# EAGLE design MazeBot Main Board (EAGLE 9.2.2)
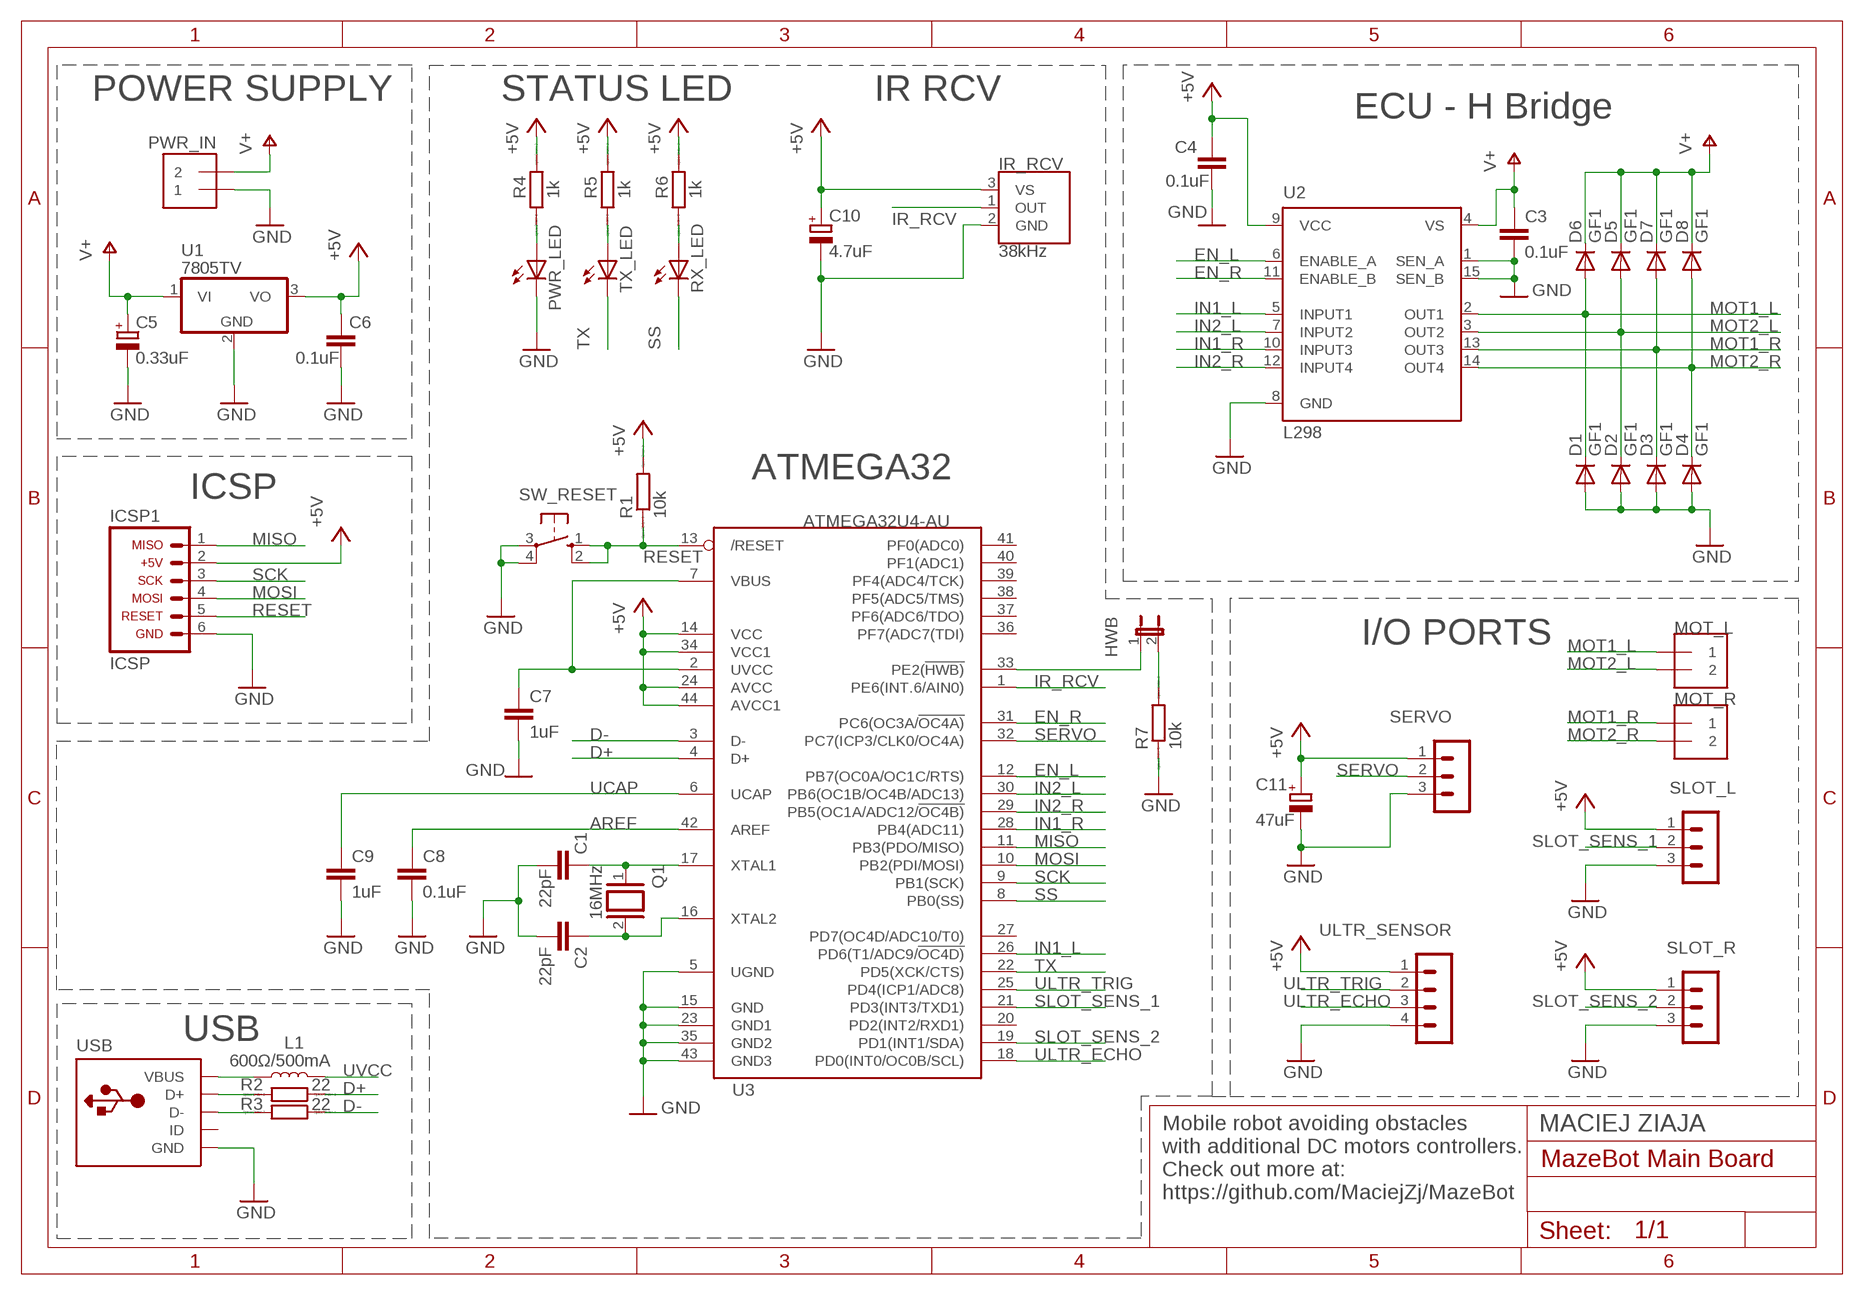
[diagram p0: schematic, sheet 1]
FRAME1 (A4L-LOC): AUTHOR: MACIEJ ZIAJA

## Parts
C1  22pF  C-EU025-024X044  [C025-024X044]
C2  22pF  C-EU025-024X044  [C025-024X044]
C3  0.1uF  C-EU025-024X044  [C025-024X044]
C4  0.1uF  C-EU025-024X044  [C025-024X044]
C5  0.33uF  CPOL-EUUD-4X5,8  [UD-4X5,8_NICHICON]
C6  0.1uF  C-EU025-024X044  [C025-024X044]
C7  1uF  C-EU025-024X044  [C025-024X044]
C8  0.1uF  C-EU025-024X044  [C025-024X044]
C9  1uF  C-EU025-024X044  [C025-024X044]
C10  4.7uF  CPOL-EUUD-6,3X8,8  [UD-6,3X5,8_NICHICON]
C11  47uF  CPOL-EUUD-6,3X8,8  [UD-6,3X5,8_NICHICON]
D1  GF1  [SMA-DO214AC]
D2  GF1  [SMA-DO214AC]
D3  GF1  [SMA-DO214AC]
D4  GF1  [SMA-DO214AC]
D5  GF1  [SMA-DO214AC]
D6  GF1  [SMA-DO214AC]
D7  GF1  [SMA-DO214AC]
D8  GF1  [SMA-DO214AC]
HWB  JP1E  [JP1]
ICSP1  ARDUINO_CONN-ICSP  [CONN-2X03]
IR_RCV  38kHz  TSOP38238  [TSOP382]
L1  600Ω/500mA  INDUCTOR-0805-3.3UH  [0805]
MOT_L  1X2-3.5MM  [1X2-3.5MM]
MOT_R  1X2-3.5MM  [1X2-3.5MM]
PWR_IN  1X2-3.5MM  [1X2-3.5MM]
PWR_LED  LEDCHIP-LED0805  [CHIP-LED0805]
Q1  16MHz  XTAL/S  [QS]
R1  10k  RR1206  [R1206]
R2  22  RR1206  [R1206]
R3  22  RR1206  [R1206]
R4  1k  RR1206  [R1206]
R5  1k  RR1206  [R1206]
R6  1k  RR1206  [R1206]
R7  10k  RR1206  [R1206]
RX_LED  LEDCHIP-LED0805  [CHIP-LED0805]
SERVO  MA03-1  [MA03-1]
SLOT_L  MA03-1  [MA03-1]
SLOT_R  MA03-1  [MA03-1]
SW_RESET  10-XX  [B3F-10XX]
TX_LED  LEDCHIP-LED0805  [CHIP-LED0805]
U1  7805TV  [TO220V]
U2  L298  [MULTIWATT-15]
U3  ATMEGA32U4-AU  [TQFP44]
ULTR_SENSOR  MA04-1  [MA04-1]
USB  USBMINIB  [USB-MINIB]

## Nets
+5V: C4.1 C6.1 C10.+ C11.+ ICSP1.2 IR_RCV.3(VS) R1.2 R4.2 R5.2 R6.2 SERVO.1 SLOT_L.1 SLOT_R.1 U1.3(VO) U2.9(VCC) U3.14(VCC) U3.24(AVCC) U3.34(VCC1) U3.44(AVCC1) ULTR_SENSOR.1
AREF: C8.1 U3.42(AREF)
D+: R2.1 U3.4(D+)
D-: R3.1 U3.3(D-)
EN_L: U2.6(ENABLE_A) U3.12(PB7(OC0A/OC1C/RTS))
EN_R: U2.11(ENABLE_B) U3.31(PC6(OC3A/!OC4A))
GND: C1.1 C2.2 C3.2 C4.2 C5.- C6.2 C7.2 C8.2 C9.2 C10.- C11.- D1.A D2.A D3.A D4.A ICSP1.6 IR_RCV.2(GND) PWR_IN.1 PWR_LED.C R7.1 SERVO.3 SLOT_L.3 SLOT_R.3 SW_RESET.3(P) SW_RESET.4(P1) U1.2(GND) U2.1(SEN_A) U2.8(GND) U2.15(SEN_B) U3.5(UGND) U3.15(GND) U3.23(GND1) U3.35(GND2) U3.43(GND3) ULTR_SENSOR.4 USB.GND
IN1_L: U2.5(INPUT1) U3.26(PD6(T1/ADC9/!OC4D))
IN1_R: U2.10(INPUT3) U3.28(PB4(ADC11))
IN2_L: U2.7(INPUT2) U3.30(PB6(OC1B/OC4B/ADC13))
IN2_R: U2.12(INPUT4) U3.29(PB5(OC1A/ADC12/!OC4B))
IR_RCV: IR_RCV.1(OUT) U3.1(PE6(INT.6/AIN0))
MISO: ICSP1.1 U3.11(PB3(PDO/MISO))
MOSI: ICSP1.4 U3.10(PB2(PDI/MOSI))
MOT1_L: D1.K(C) D6.A MOT_L.1 U2.2(OUT1)
MOT1_R: D3.K(C) D7.A MOT_R.1 U2.13(OUT3)
MOT2_L: D2.K(C) D5.A MOT_L.2 U2.3(OUT2)
MOT2_R: D4.K(C) D8.A MOT_R.2 U2.14(OUT4)
N$1: C1.2 Q1.1 U3.17(XTAL1)
N$2: C2.1 Q1.2 U3.16(XTAL2)
N$3: PWR_LED.A R4.1
N$4: R2.2 USB.D+
N$5: R3.2 USB.D-
N$6: R5.1 TX_LED.A
N$7: R6.1 RX_LED.A
N$8: HWB.1 U3.33(PE2(!HWB))
N$9: HWB.2 R7.2
N$10: L1.1 USB.VBUS
RESET: ICSP1.5 R1.1 SW_RESET.1(S) SW_RESET.2(S1) U3.13(/RESET)
SCK: ICSP1.3 U3.9(PB1(SCK))
SERVO: SERVO.2 U3.32(PC7(ICP3/CLK0/OC4A))
SLOT_SENS_1: SLOT_L.2 U3.21(PD3(INT3/TXD1))
SLOT_SENS_2: SLOT_R.2 U3.19(PD1(INT1/SDA))
SS: RX_LED.C U3.8(PB0(SS))
TX: TX_LED.C U3.22(PD5(XCK/CTS))
UCAP: C9.1 U3.6(UCAP)
ULTR_ECHO: U3.18(PD0(INT0/OC0B/SCL)) ULTR_SENSOR.3
ULTR_TRIG: U3.25(PD4(ICP1/ADC8)) ULTR_SENSOR.2
UVCC: C7.1 L1.2 U3.2(UVCC) U3.7(VBUS)
V+: C3.1 C5.+ D5.K(C) D6.K(C) D7.K(C) D8.K(C) PWR_IN.2 U1.1(VI) U2.4(VS)
Unconnected: U3.20(PD2(INT2/RXD1)) U3.27(PD7(OC4D/ADC10/T0)) U3.36(PF7(ADC7(TDI)) U3.37(PF6(ADC6/TDO)) U3.38(PF5(ADC5/TMS)) U3.39(PF4(ADC4/TCK)) U3.40(PF1(ADC1)) U3.41(PF0(ADC0)) USB.ID

## Notes on the sheet
- POWER SUPPLY | STATUS LED | IR RCV
- ECU - H Bridge
- ATMEGA32
- ICSP
- I/O PORTS
- USB
- Mobile robot avoiding obstacles
  with additional DC motors controllers.
  Check out more at:
  https://github.com/MaciejZj/MazeBot

## Library data of the parts
C1-C4 C6-C9 = rcl:C-EU: CAPACITOR, European symbol; SPICEPREFIX: C
C5 C10 C11 = rcl:CPOL-EU: POLARIZED CAPACITOR, European symbol; SPICEPREFIX: C
D1-D8 = diode:GF1: DIODE
HWB = jumper:JP1E: JUMPER
ICSP1 = arduino_jw:ARDUINO_CONN-ICSP: Arduino ICSP I/O Header This is the ICSP I/O header on the Arduino Uno R3. This connector is labeled with the following pin assignments: MISO +5V SCK MOSI RESET GND NOTE: Be sure you install this connector with the correct orientation on your PCB layout. Pin 1 has a square pad to assist with orientation.
IR_RCV = SparkFun-Sensors:TSOP382: Vishay Semiconductor TSOP32838 - 38kHz IR Receiver These products are miniaturized IR receiver modules for infrared remote control systems. A PIN diode and a preamplifier are assembled on a leadframe, the epoxy package contains an IR filter. The demodulated output signal can be directly connected to a microprocessor for decoding.; PROD_ID: SEN-10266
L1 = SparkFun-Coils:INDUCTOR: Inductors Resist changes in electrical current. Basically a coil of wire. SparkFun Products: SparkFun Load Cell Amplifier - HX711 <https://www.sparkfun.com/products/13879> IOIO-OTG - V2.2 <https://www.sparkfun.com/products/13613>; PROD_ID: NDUC-13076; VALUE: 3.3µH/±20%/450mA
MOT_L MOT_R PWR_IN = adafruit:1X2: 3.5mm Terminal block http://www.ladyada.net/library/pcb/eaglelibrary.html
PWR_LED RX_LED TX_LED = led:LED: LED OSRAM: - CHIPLED LG R971, LG N971, LY N971, LG Q971, LY Q971, LO R971, LY R971 LH N974, LH R974 LS Q976, LO Q976, LY Q976 LO Q996 - Hyper CHIPLED LW Q18S LB Q993, LB Q99A, LB R99A - SideLED LS A670, LO A670, LY A670, LG A670, LP A670 LB A673, LV A673, LT A673, LW A673 LH A674 LY A675 LS A676, LA A676, LO A676, LY A676, LW A676 LS A679, LY A679, LG A679 - Hyper Micro SIDELED® LS Y876, LA Y876, LO Y876, LY Y876 LT Y87S - SmartLED LW L88C, LW L88S LB L89C, LB L89S, LG L890 LS L89K, LO L89K, LY L89K LS L896, LA L896, LO L896, LY L896 - TOPLED LS T670, LO T670, LY T670, LG T670, LP T670 LSG T670, LSP T670, LSY T670, LOP T670, LYG T670 LG T671, LOG T671, LSG T671 LB T673, LV T673, LT T673, LW T673 LH T674 LS T676, LA T676, LO T676, LY T676, LB T676, LH T676, LSB T676, LW T676 LB T67C, LV T67C, LT T67C, LS T67K, LO T67K, LY T67K, LW E67C LS E67B, LA E67B, LO E67B, LY E67B, LB E67C, LV E67C, LT E67C LW T67C LS T679, LY T679, LG T679 LS T770, LO T770, LY T770, LG T770, LP T770 LB T773, LV T773, LT T773, LW T773 LH T774 LS E675, LA E675, LY E675, LS T675 LS T776, LA T776, LO T776, LY T776, LB T776 LHGB T686 LT T68C, LB T68C - Hyper Mini TOPLED® LB M676 - Mini TOPLED Santana® LG M470 LS M47K, LO M47K, LY M47K Source: http://www.osram.convergy.de LUXEON: - LUMILED® LXK2-PW12-R00, LXK2-PW12-S00, LXK2-PW14-U00, LXK2-PW14-V00 LXK2-PM12-R00, LXK2-PM12-S00, LXK2-PM14-U00 LXK2-PE12-Q00, LXK2-PE12-R00, LXK2-PE12-S00, LXK2-PE14-T00, LXK2-PE14-U00 LXK2-PB12-K00, LXK2-PB12-L00, LXK2-PB12-M00, LXK2-PB14-N00, LXK2-PB14-P00, LXK2-PB14-Q00 LXK2-PR12-L00, LXK2-PR12-M00, LXK2-PR14-Q00, LXK2-PR14-R00 LXK2-PD12-Q00, LXK2-PD12-R00, LXK2-PD12-S00 LXK2-PH12-R00, LXK2-PH12-S00 LXK2-PL12-P00, LXK2-PL12-Q00, LXK2-PL12-R00 Source: www.luxeon.com KINGBRIGHT: KA-3528ASYC Source: www.kingbright.com
Q1 = special:XTAL/S: CRYSTAL
R1-R7 = eagle-ltspice:R: RESISTOR, European symbol; SPICEMODEL: NONE; SPICEPREFIX: R
SERVO SLOT_L SLOT_R = EAGLE_std_edits_MZ:MA03-1: PIN HEADER; OC_FARNELL: unknown; OC_NEWARK: unknown
SW_RESET = switch-omron:10-XX: OMRON SWITCH; MPN: B3F-1000; OC_FARNELL: 176432; OC_NEWARK: 36M3542
U1 = linear:78*: Positive VOLTAGE REGULATOR Source: http://cache.national.com/ds/LM/LM78L05.pdf http://www.fairchildsemi.com/ds/LM/LM7805.pdf
U2 = EAGLE_std_edits_MZ:L298: DUAL FULL-BRIDGE DRIVER; MPN: L298N; OC_FARNELL: 1589425; OC_NEWARK: 32M1527
U3 = adafruit:ATMEGA32U4: http://www.ladyada.net/library/eagle
ULTR_SENSOR = EAGLE_std_edits_MZ:MA04-1: PIN HEADER; OC_FARNELL: unknown; OC_NEWARK: unknown
USB = adafruit:USB: USB Connectors USBMINIB - Surface Mount Female Mini-B USB Connector 4UConnector: 06564 By microbuilder.eu Thru-hole RA Female Mini-B USB Connector 4UConnector: 18732 By ladyada.net

## Board
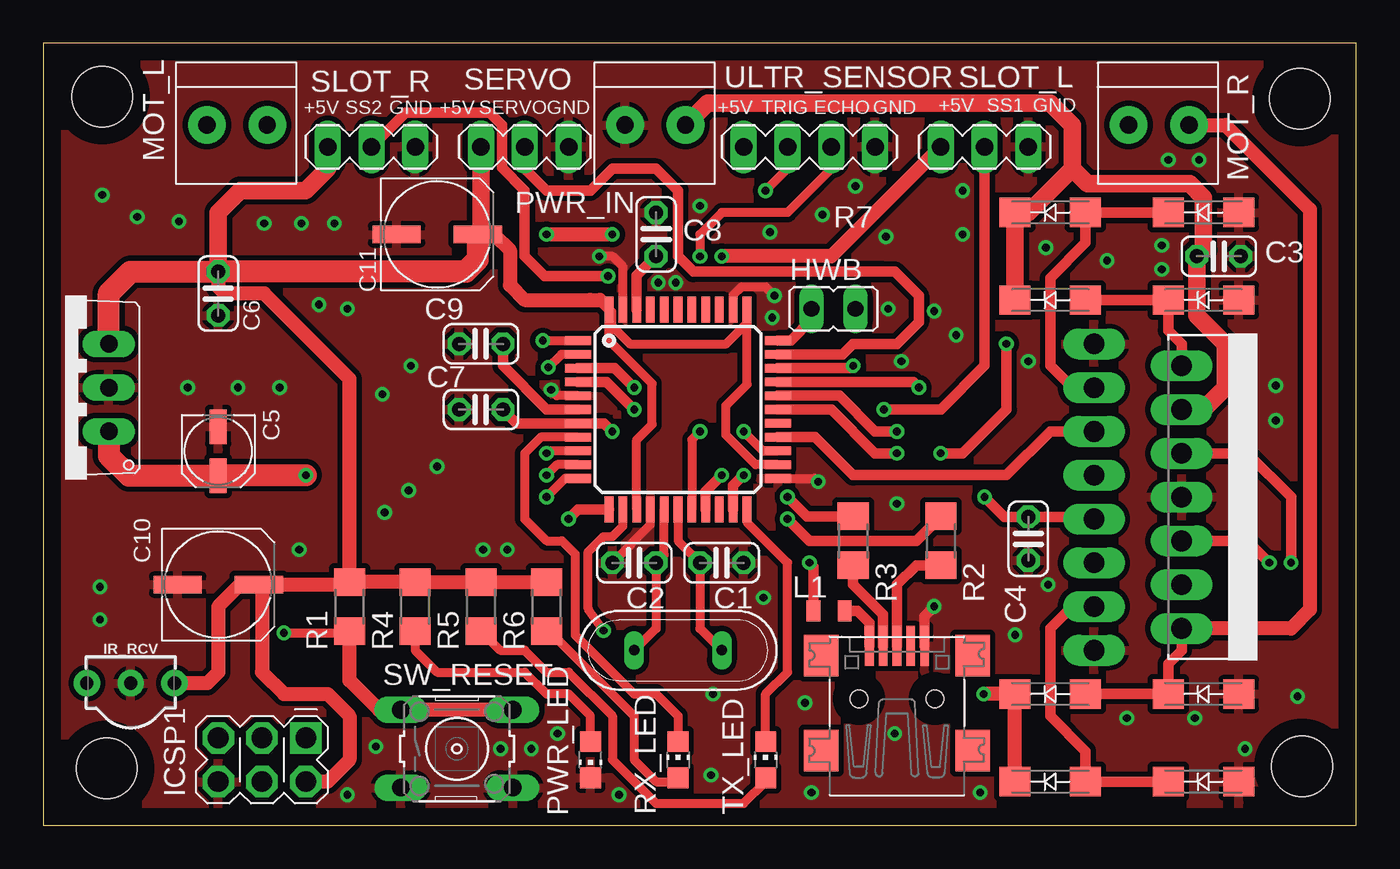
[diagram p1: board, top side]
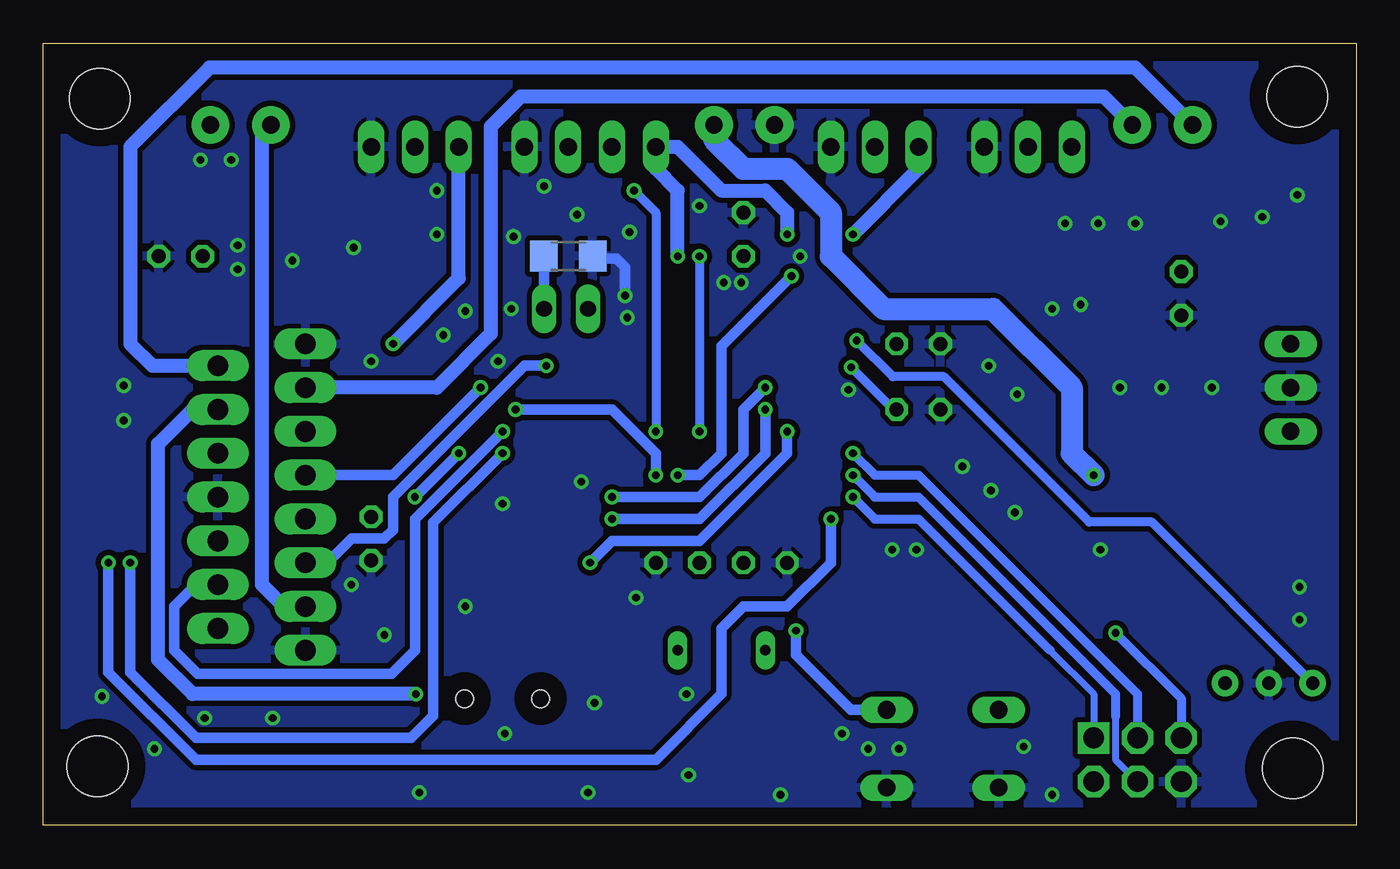
[diagram p2: board, bottom side, seen from below]

Size 76.18 x 45.39 mm. Coordinates in mm from the lower left corner, seen from the top.
Outline: 0,0 76.18,0 76.18,45.39 0,45.39 0,0
Copper layers (1*16): Top 0.035mm / dielectric 1.5mm / Bottom 0.035mm
Design rules "default": minimum track width 6mil, minimum drill 0.35mm, track to track 6mil, track to pad 6mil, pad to pad 6mil, via to via 6mil, smd to smd 6mil, copper to edge 40mil, drill to drill 6mil, minimum pad ring 10mil, minimum via ring 8mil, stop-mask expansion 4mil, vias tented up to drill 0mil, thermal gap 10mil
Holes 3.5 mm at 3.68,3.3 3.43,42.29 73.03,3.43 72.9,42.16

### Footprints (pad centres in the part's own frame; a part is rotated, then mirrored left to right if it is on the bottom)
C025-024X044 = drill 0.813 octagon: 1 -1.27,0; 2 1.27,0
UD-4X5,8_NICHICON = smd 2 x 1: + 1.425,0; - -1.425,0
UD-6,3X5,8_NICHICON = smd 2.8 x 1: + 2.35,0; - -2.35,0
SMA-DO214AC = smd 1.8 x 1.7: A -2.05,0; K 2.05,0
JP1 = drill 0.914 long: 1 0,-1.27; 2 0,1.27
CONN-2X03 = drill 1.2 pad 1.829 square: 1 0,0 | drill 1.2 pad 1.829 octagon: 2 2.54,0; 3 0,-2.54; 4 2.54,-2.54; 5 0,-5.08; 6 2.54,-5.08
TSOP382 = drill 0.762 pad 1.524: 1 -2.54,0; 2 0,0; 3 2.54,0
0805 = smd 0.8 x 1.2: 1 -0.9,0; 2 0.9,0
1X2-3.5MM = drill 1 pad 2.184: 1 1.8,0; 2 -1.7,0
CHIP-LED0805 = smd 1.2 x 1.2: A 0,-1.05; C 0,1.05
QS = drill 0.61 long: 1 -2.54,0; 2 2.54,0
R1206 = smd 1.6 x 1.803: 1 -1.422,0; 2 1.422,0
MA03-1 = drill 1.016 long: 1 -2.54,0; 2 0,0; 3 2.54,0
B3F-10XX = drill 1.016 long: 1 -3.251,2.261; 2 3.251,2.261; 3 -3.251,-2.261; 4 3.251,-2.261
TO220V = drill 1.016 long: 1 -2.54,-2.54; 2 0,-2.54; 3 2.54,-2.54
MULTIWATT-15 = drill 1.2 long: 1 -8.89,-7.62; 2 -7.62,-2.54; 3 -6.35,-7.62; 4 -5.08,-2.54; 5 -3.81,-7.62; 6 -2.54,-2.54; 7 -1.27,-7.62; 8 0,-2.54; 9 1.27,-7.62; 10 2.54,-2.54; 11 3.81,-7.62; 12 5.08,-2.54; 13 6.35,-7.62; 14 7.62,-2.54; 15 8.89,-7.62
TQFP44 = smd 1.5 x 0.5: 1 -5.8,4; 2 -5.8,3.2; 3 -5.8,2.4; 4 -5.8,1.6; 5 -5.8,0.8; 6 -5.8,0; 7 -5.8,-0.8; 8 -5.8,-1.6; 9 -5.8,-2.4; 10 -5.8,-3.2; 11 -5.8,-4; 23 5.8,-4; 24 5.8,-3.2; 25 5.8,-2.4; 26 5.8,-1.6; 27 5.8,-0.8; 28 5.8,0; 29 5.8,0.8; 30 5.8,1.6; 31 5.8,2.4; 32 5.8,3.2; 33 5.8,4 | smd 0.5 x 1.5: 12 -4,-5.8; 13 -3.2,-5.8; 14 -2.4,-5.8; 15 -1.6,-5.8; 16 -0.8,-5.8; 17 0,-5.8; 18 0.8,-5.8; 19 1.6,-5.8; 20 2.4,-5.8; 21 3.2,-5.8; 22 4,-5.8; 34 4,5.8; 35 3.2,5.8; 36 2.4,5.8; 37 1.6,5.8; 38 0.8,5.8; 39 0,5.8; 40 -0.8,5.8; 41 -1.6,5.8; 42 -2.4,5.8; 43 -3.2,5.8; 44 -4,5.8
MA04-1 = drill 1.016 long: 1 -3.81,0; 2 -1.27,0; 3 1.27,0; 4 3.81,0
USB-MINIB = smd 0.5 x 2.308: D+ 0,4.064; D- -0.8,4.064; GND 1.6,4.064; ID 0.8,4.064; VBUS -1.6,4.064 | smd 2 x 2.4: GND1 -4.4,-2; GND2 -4.4,3.5; GND3 4.4,3.5; GND4 4.4,-2 | hole 1: -2.2,1; 2.2,1

### Placement (x,y rotation side)
C1  39.37,15.24 180 top
C2  34.29,15.24 180 top
C3  68.2,33.02 0 top
C4  57.15,16.64 270 top
C5  10.16,21.72 270 top
C6  10.16,30.86 270 top
C7  25.4,24.13 180 top
C8  35.56,34.29 90 top
C9  25.4,27.94 180 top
C10  10.16,13.97 0 top
C11  22.86,34.29 0 top
D1  67.31,30.48 180 top
D2  67.31,35.56 180 top
D3  67.31,2.54 180 top
D4  67.31,7.62 180 top
D5  58.42,35.56 180 top
D6  58.42,30.48 180 top
D7  58.42,2.54 180 top
D8  58.42,7.62 180 top
HWB  45.85,29.97 270 top
ICSP1  15.24,5.08 270 top
IR_RCV  5.08,8.26 0 top
L1  45.59,12.45 180 top
MOT_L  11.3,40.64 180 top
MOT_R  64.77,40.64 180 top
PWR_IN  35.56,40.64 180 top
PWR_LED  31.75,3.81 180 top
Q1  36.83,10.16 180 top
R1  17.78,12.7 90 top
R2  52.07,16.51 270 top
R3  46.99,16.51 270 top
R4  21.59,12.7 90 top
R5  25.4,12.7 90 top
R6  29.21,12.7 90 top
R7  45.72,33.02 180 bottom
RX_LED  36.83,3.81 0 top
SERVO  27.94,39.37 0 top
SLOT_L  54.61,39.37 0 top
SLOT_R  19.05,39.37 0 top
SW_RESET  24,4.45 0 top
TX_LED  41.91,3.81 0 top
U1  1.27,25.4 90 top
U2  68.58,19.05 270 top
U3  36.83,24.13 0 top
ULTR_SENSOR  44.45,39.37 0 top
USB  49.53,6.35 0 top

### Tracks (layer width: path | path; a pad name or v marks a point on that pad's centre or on a via)
+5V  (via drill 0.45)
  Top 0.508: U3.14 34.43,22.36 35.33,23.26 35.33,25.64 32.83,28.14 U3.44 32.97,29.79 32.97,29.01 34.05,27.94 39.62,27.94 40.83,29.16 U3.34 40.83,25.59 39.6,24.36 39.6,22.66 41.33,20.93 U3.24
  Top 0.61: v52.07,21.59 53.34,21.59 55.88,24.13 v55.88,27.94 | v54.61,19.05 55.75,17.91 C4.1 60.83,17.91 U2.9 | 32.28,30.48 U3.44
  Top 0.813: 25.4,34.48 C11.+ 26.16,34.29 27.08,33.38 27.08,31.34 27.94,30.48 31.75,30.48 32.28,30.48 | R1.2 R4.2 R5.2 R6.2 | C10.+ 17.63,13.97 R1.2 | C10.+ 12.7,13.78 12.7,8.89 13.97,7.62 16.51,7.62 17.78,6.35 17.78,3.81 16.51,2.54 ICSP1.2 | C10.+ 11.43,13.97 10.16,12.7 10.16,8.89 9.53,8.26 IR_RCV.3 | SLOT_L.1 45.72,33.02 v39.37,33.02 | v33.02,34.29 v29.21,34.29 | C6.1 10.16,31.24 10.54,30.86 12.83,30.86 17.78,25.91 R1.2
  Top 1.016: 25.4,34.48 SERVO.1 | SLOT_R.1 16.51,38.1 15.24,36.83 11.43,36.83 10.16,35.56 C6.1
  Top 1.27: C11.+ 25.21,32.83 24.51,32.13 C6.1 5.08,32.13 3.81,30.86 U1.3
  Bottom 0.61: v54.61,19.05 v52.07,21.59
  Bottom 0.813: v55.88,27.94 52.07,31.75 SLOT_L.1 | v39.37,33.02 39.37,36.83 40.64,38.1 ULTR_SENSOR.1 39.37,39.37 36.83,36.83 34.29,36.83 33.02,35.56 v33.02,34.29 | v29.21,34.29 25.4,38.1 SERVO.1
AREF
  Top 0.61: C8.1 34.43,31.89 U3.42
D+  (via drill 0.45)
  Top 0.61: R2.1 50.65,16.51 44.45,16.51 v43.18,17.78 | U3.4 32.69,25.73 v34.29,24.13
  Bottom 0.61: v43.18,17.78 38.1,17.78 34.29,21.59 v34.29,24.13
D-  (via drill 0.45)
  Top 0.61: R3.1 44.3,17.93 v43.18,19.05 | U3.3 33.16,26.53 v34.29,25.4
  Bottom 0.61: v43.18,19.05 38.1,19.05 35.56,21.59 35.56,24.13 v34.29,25.4
EN_L  (via drill 0.45)
  Top 0.61: U2.6 69.85,21.59 72.39,19.05 v72.39,15.24 | v30.48,17.78 31.03,18.33 U3.12
  Bottom 0.61: v72.39,15.24 72.39,8.89 67.31,3.81 | v30.48,17.78 30.48,15.24 33.02,12.7 35.56,12.7 36.83,11.43 36.83,7.62 40.64,3.81 | 67.31,3.81 40.64,3.81 | 67.31,3.81 40.64,3.81
EN_R  (via drill 0.45)
  Top 0.61: v46.99,26.67 46.85,26.53 U3.31
  Bottom 0.61: U2.11 59.69,15.24 58.29,16.64 56.39,16.64 55.88,17.14 55.88,19.05 48.26,26.67 v46.99,26.67
GND  (via drill 0.45)
  Top 0.508: U3.5 29.81,24.93 v29.46,25.27 | U3.43 33.63,32.41 33.02,33.02 v32.26,33.02 | v42.42,30.73 41.91,31.24 40.51,31.24 40.03,30.76 U3.35 | C2.2 35.23,17.45 U3.15 | U3.23 44.77,20.13 v44.96,19.94
  Top 0.61: USB.GND 51.13,12.14 v51.69,12.7
  Bottom 0.61: v42.42,30.73 42.42,32.38 42.93,32.89 44.17,32.89 R7.1
  other vias: 49.53,18.67 62.87,6.22 66.8,6.22 69.72,4.45 72.77,7.49 58.29,13.97 56.39,11.05 38.1,35.94 35.69,31.5 36.7,31.5 48.9,34.16 49.78,26.92 42.16,34.42 45.21,35.43 47.12,37.08 3.3,13.84 3.3,11.94 19.81,18.16 22.86,20.83 19.68,25.02 21.34,26.67 12.83,34.92 14.99,34.92 16.89,34.92 17.65,29.97 16,30.23 21.21,19.43 3.43,36.58 5.46,35.31 7.87,35.05 19.3,4.57 17.65,1.78 28.32,4.45 26.54,4.45 29.84,5.33 33.4,1.78 41.78,13.21 38.86,7.62 38.73,2.92 44.2,7.11 44.58,1.91 54.36,1.91 49.4,5.33 53.34,36.83 53.34,34.29 14.86,16 58.17,33.53 61.72,32.77 67.06,38.61 65.28,38.61 57.15,26.92 51.69,29.84 52.96,28.45 25.53,16 26.92,16 49.02,29.97 42.29,29.46 64.9,33.66 64.9,32.26 71.5,25.53 71.5,23.5 8.38,25.4 11.3,25.4 13.72,25.4
  pour Top (isolate 0.305): 0,45.72 0,0 76.2,0 76.2,44.45 76.2,45.72
  pour Bottom (isolate 0.305): 0,45.72 0,0 76.2,0 76.2,45.72
IN1_L
  Top 0.61: U2.5 58.42,22.86 55.88,20.32 46.99,20.32 44.78,22.53 U3.26
IN1_R  (via drill 0.45)
  Top 0.61: U3.28 45.72,24.13 48.26,21.59 v49.53,21.59 | v71.12,15.24 69.85,16.51 U2.10
  Bottom 0.61: v49.53,21.59 53.55,17.57 53.55,6.35 54.82,5.08 67.31,5.08 71.12,8.89 v71.12,15.24
IN2_L  (via drill 0.45)
  Top 0.61: v50.8,25.4 50.47,25.73 U3.30
  Bottom 0.61: U2.7 55.88,20.32 v50.8,25.4
IN2_R  (via drill 0.45)
  Top 0.61: U3.29 46.19,24.93 48.26,22.86 v49.53,22.86
  Bottom 0.61: v49.53,22.86 54.61,17.78 54.61,10.16 55.97,8.8 67.22,8.8 68.58,10.16 68.58,12.7 67.31,13.97 U2.12
IR_RCV  (via drill 0.45)
  Top 0.508: v28.99,28.13 U3.1
  Bottom 0.508: IR_RCV.1 11.88,17.59 15.5,17.59 23.94,26.04 26.89,26.04 v28.99,28.13
MISO  (via drill 0.45)
  Top 0.508: U3.11 30.29,20.13 v29.21,19.05
  Bottom 0.406: 17.78,10.16 15.24,7.62 ICSP1.1
  Bottom 0.508: v29.21,19.05 27.94,17.78 25.4,17.78 17.78,10.16
MOSI  (via drill 0.45)
  Top 0.508: U3.10 29.82,20.93 v29.21,20.32
  Bottom 0.406: 13.97,6.35 13.97,3.81 ICSP1.4
  Bottom 0.508: v29.21,20.32 27.94,19.05 25.4,19.05 17.14,10.79 17.02,10.67 13.97,7.62 13.97,6.35
MOT1_L
  Top 0.61: D6.A D1.K 65.26,28.72 66.04,27.94 U2.2
  Bottom 0.813: MOT_L.1 12.83,43.97 66.52,43.97 71.12,39.37 71.12,27.94 69.85,26.67 U2.2
MOT1_R
  Top 0.61: U2.13 59.69,12.7 58.42,11.43 58.42,6.35 60.47,4.3 D7.A D3.K
  Bottom 0.813: MOT_R.1 63.5,40.11 63.5,13.97 62.23,12.7 U2.13
MOT2_L
  Top 0.61: U2.3 59.69,25.4 58.42,26.67 58.42,31.75 60.47,33.8 D5.A D2.K
  Bottom 0.813: MOT_L.2 14.65,42.29 48.48,42.29 50.22,40.55 50.22,28.52 53.34,25.4 U2.3
MOT2_R
  Top 0.61: U2.14 66.04,10.16 65.26,9.38 D4.K D8.A
  Top 0.813: U2.14 72.39,11.43 73.49,12.53 73.49,35.73 68.58,40.64 MOT_R.2
N$1
  Top 0.508: U3.17 36.83,16.51 C1.2 38.1,11.43 Q1.1
N$2
  Top 0.508: U3.16 36.03,15.71 C2.1 35.56,11.43 Q1.2
N$3
  Top 0.508: PWR_LED.A 31.75,6.35 30.48,7.62 29.21,7.62 27.94,8.89 22.86,8.89 21.59,10.16 R4.1
N$4
  Top 0.61: R2.2 50.65,15.09 49.53,13.97 USB.D+
N$5
  Top 0.61: R3.2 46.99,13.97 48.73,12.23 USB.D-
N$6
  Top 0.508: R5.1 26.52,10.16 27.94,10.16 29.21,8.89 30.48,8.89 33.02,6.35 33.02,3.81 35.56,1.27 40.64,1.27 41.91,2.54 TX_LED.A
N$7
  Top 0.508: R6.1 29.36,11.28 34.29,6.35 34.29,3.81 35.56,2.54 36.61,2.54 RX_LED.A
N$8
  Top 0.61: HWB.1 44.58,29.34 43.37,28.13 U3.33
N$9
  Bottom 0.61: HWB.2 47.12,32.99 R7.2
N$10
  Top 0.61: USB.VBUS 47.93,11.76 47.24,12.45 L1.1
RESET  (via drill 0.45)
  Top 0.508: v32.51,11.3 31.62,12.57 31.62,15.88 32.51,16.76 33.02,16.76 33.63,17.37 U3.13 | v13.97,11.18 17.68,11.18 R1.1
  Top 0.813: R1.1 17.78,8.41 19.48,6.71 SW_RESET.1 SW_RESET.2
  Bottom 0.508: v13.97,11.18 10.16,7.37 ICSP1.5
  Bottom 0.61: SW_RESET.2 29.31,6.71 32.51,9.91 v32.51,11.3
SCK  (via drill 0.45)
  Top 0.508: U3.9 29.35,21.73 v29.21,21.59
  Bottom 0.508: v29.21,21.59 27.94,20.32 25.4,20.32 12.7,7.62 ICSP1.3
SERVO
  Top 0.61: SERVO.2 27.94,38.1 29.21,36.83 31.75,36.83 33.02,38.1 35.56,38.1 36.83,36.83 36.83,33.02 37.72,32.13 48.26,32.13 48.77,32.13 49.4,32.13 50.8,30.73 50.8,29.21 49.53,27.94 46.99,27.94 46.38,27.33 U3.32
SLOT_SENS_1  (via drill 0.45)
  Top 0.61: SLOT_L.2 54.61,26.67 52.07,24.13 v48.77,24.13 | v40.64,20.32 40.03,19.71 U3.21
  Bottom 0.61: v48.77,24.13 43.18,24.13 40.64,21.59 v40.64,20.32
SLOT_SENS_2  (via drill 0.45)
  Top 0.61: SLOT_R.2 21.03,41.35 25.91,41.35 26.62,40.64 26.62,38.15 27.94,36.83 27.94,33.02 29.08,31.88 v32.77,31.88 | U3.19 38.43,19.38 v39.37,20.32
  Bottom 0.61: v32.77,31.88 36.83,27.81 36.83,21.59 38.1,20.32 v39.37,20.32
SS
  Top 0.508: U3.8 28.88,22.53 27.94,21.59 27.94,17.78 29.21,16.51 30.1,16.51 30.86,15.75 30.86,11.05 34.29,7.62 35.56,7.62 36.83,6.35 RX_LED.C
TX
  Top 0.508: U3.22 40.83,17.59 43.18,15.24 43.18,8.89 41.91,7.62 TX_LED.C
UCAP
  Top 0.61: U3.6 29.21,24.13 26.67,26.67 C9.1
ULTR_ECHO  (via drill 0.45)
  Top 0.508: ULTR_SENSOR.3 45.72,38.1 43.18,35.56 39.37,35.56 38.1,34.29 v38.1,33.02 | v38.1,22.86 37.63,22.39 U3.18
  Bottom 0.508: v38.1,33.02 v38.1,22.86
ULTR_TRIG  (via drill 0.45)
  Top 0.508: ULTR_SENSOR.2 43.18,38.1 v41.91,36.83 | v40.64,22.86 41.77,21.73 U3.25
  Bottom 0.508: v41.91,36.83 40.64,35.56 v40.64,22.86
UVCC  (via drill 0.45)
  Top 0.508: U3.2 30.06,27.33 v29.3,26.58
  Top 0.61: C7.1 27.47,23.33 U3.7 32.55,23.33 v33.02,22.86 | L1.2 44.69,15 v44.45,15.24
  Bottom 0.508: v29.3,26.58 26.86,24.13 C7.1
  Bottom 0.61: v44.45,15.24 43.18,16.51 38.1,16.51 33.02,21.59 v33.02,22.86
V+  (via drill 0.45)
  Top 0.813: D7.K D8.K v54.56,7.62 | 57.15,35.56 D5.K
  Top 1.016: PWR_IN.2 38.53,41.91 58.42,41.91 59.69,40.64 59.69,38.1 | 59.69,38.1 57.15,35.56 | D5.K D6.K | 59.69,38.1 60.57,37.22 66.52,37.22 67.31,36.43 67.31,33.4 C3.1 66.93,29.59 68.58,27.94 68.58,25.4 67.31,24.13 U2.4
  Top 1.27: U1.1 3.81,21.46 4.98,20.29 C5.+ 10.19,20.32 v15.24,20.32
  Bottom 0.813: v54.56,7.62 67.52,7.62 69.52,9.62 69.52,22.13 67.52,24.13 U2.4
  Bottom 1.27: PWR_IN.2 37.26,39.8 35.56,38.1 33.02,38.1 30.48,35.56 30.48,33.02 27.43,29.97 21.08,29.97 16.51,25.4 16.51,21.59 v15.24,20.32

### Text on the board
tNames: +5V | SS2 | GND | +5V | SERVO | GND | +5V | TRIG | ECHO | GND | +5V | SS1 | GND